# EAGLE design sniff (EAGLE 5.07)
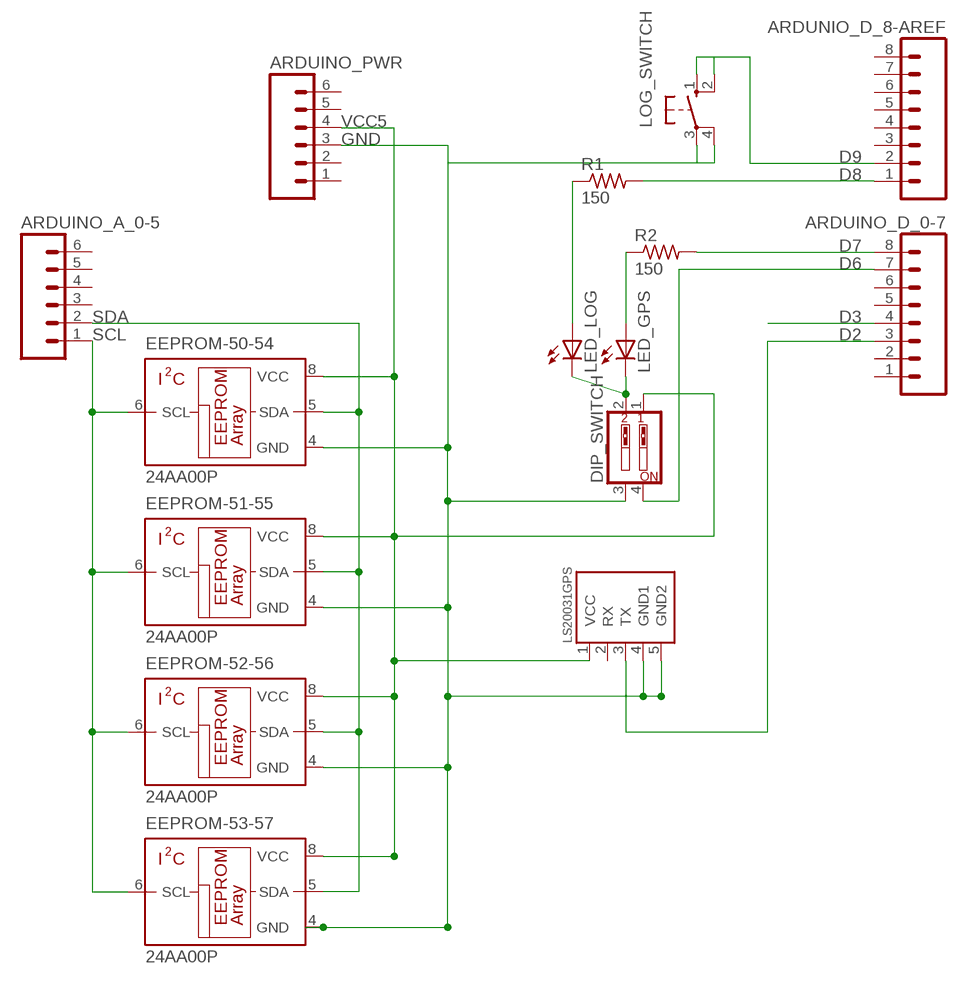
[diagram p0: schematic, sheet 1]

## Parts
ARDUINO_A_0-5  M06SIP  [1X06]
ARDUINO_D_0-7  M08  [1X08]
ARDUINO_PWR  M06SIP  [1X06]
ARDUNIO_D_8-AREF  M08  [1X08]
DIP_SWITCH  SW_DIP-2  [EDG-02]
EEPROM-50-54  24AA00P  [DIL8]
EEPROM-51-55  24AA00P  [DIL8]
EEPROM-52-56  24AA00P  [DIL8]
EEPROM-53-57  24AA00P  [DIL8]
LED_GPS  LED5MM  [LED5MM]
LED_LOG  LED5MM  [LED5MM]
LOG_SWITCH  10-XX  [B3F-10XX]
LS20031GPS  LS20031  [HEADER_1X05]
R1  150  R-US_0207/12  [0207/12]
R2  150  R-US_0207/12  [0207/12]

## Nets
D2: ARDUINO_D_0-7.3 LS20031GPS.3(TX)
D3: ARDUINO_D_0-7.4
D6: ARDUINO_D_0-7.7 DIP_SWITCH.4
D7: ARDUINO_D_0-7.8 R2.2
D8: ARDUNIO_D_8-AREF.1 R1.2
D9: ARDUNIO_D_8-AREF.2 LOG_SWITCH.1(S) LOG_SWITCH.2(S1)
GND: ARDUINO_PWR.3 DIP_SWITCH.3 EEPROM-50-54.4(GND) EEPROM-51-55.4(GND) EEPROM-52-56.4(GND) EEPROM-53-57.4(GND) LOG_SWITCH.3(P) LOG_SWITCH.4(P1) LS20031GPS.4(GND1) LS20031GPS.5(GND2)
N$3: LED_LOG.A R1.1
N$4: DIP_SWITCH.2 LED_GPS.K(C) LED_LOG.K(C)
N$5: LED_GPS.A R2.1
SCL: ARDUINO_A_0-5.1 EEPROM-50-54.6(SCL) EEPROM-51-55.6(SCL) EEPROM-52-56.6(SCL) EEPROM-53-57.6(SCL)
SDA: ARDUINO_A_0-5.2 EEPROM-50-54.5(SDA) EEPROM-51-55.5(SDA) EEPROM-52-56.5(SDA) EEPROM-53-57.5(SDA)
VCC5: ARDUINO_PWR.4 DIP_SWITCH.1 EEPROM-50-54.8(VCC) EEPROM-51-55.8(VCC) EEPROM-52-56.8(VCC) EEPROM-53-57.8(VCC) LS20031GPS.1(VCC)
Unconnected: ARDUINO_A_0-5.3 ARDUINO_A_0-5.4 ARDUINO_A_0-5.5 ARDUINO_A_0-5.6 ARDUINO_D_0-7.1 ARDUINO_D_0-7.2 ARDUINO_D_0-7.5 ARDUINO_D_0-7.6 ARDUINO_PWR.1 ARDUINO_PWR.2 ARDUINO_PWR.5 ARDUINO_PWR.6 ARDUNIO_D_8-AREF.3 ARDUNIO_D_8-AREF.4 ARDUNIO_D_8-AREF.5 ARDUNIO_D_8-AREF.6 ARDUNIO_D_8-AREF.7 ARDUNIO_D_8-AREF.8 LS20031GPS.2(RX)

## Library data of the parts
ARDUINO_A_0-5 ARDUINO_PWR = SparkFun:M06: Header 6 Standard 6-pin 0.1" header. Use with straight break away headers (SKU : PRT-00116), right angle break away headers (PRT-00553), swiss pins (PRT-00743), machine pins (PRT-00117), and female headers (PRT-00115). Molex polarized connector foot print use with SKU : PRT-08094 with associated crimp pins and housings. NOTES ON THE VARIANTS LOCK and LOCK_LONGPADS... This footprint was designed to help hold the alignment of a through-hole component (i.e. 6-pin header) while soldering it into place. You may notice that each hole has been shifted either up or down by 0.005 of an inch from it's more standard position (which is a perfectly straight line). This slight alteration caused the pins (the squares in the middle) to touch the edges of the holes. Because they are alternating, it causes a "brace" to hold the component in place. 0.005 has proven to be the perfect amount of "off-center" position when using our standard breakaway headers. Although looks a little odd when you look at the bare footprint, once you have a header in there, the alteration is very hard to notice. Also, if you push a header all the way into place, it is covered up entirely on the bottom side. This idea of altering the position of holes to aid alignment will be further integrated into the Sparkfun Library for other footprints. It can help hold any component with 3 or more connection pins.
ARDUINO_D_0-7 ARDUNIO_D_8-AREF = SparkFun:M08: Header 8 Standard 8-pin 0.1" header. Use with straight break away headers (SKU : PRT-00116), right angle break away headers (PRT-00553), swiss pins (PRT-00743), machine pins (PRT-00117), and female headers (PRT-00115).
DIP_SWITCH = special:SW_DIP-2: DIP SWITCH
EEPROM-50-54 EEPROM-51-55 EEPROM-52-56 EEPROM-53-57 = microchip:24*00: Serial EEPROM 128 bit, I2C (AA = 1.8 V/LC = 2.5 V/C = 5.0 V)
LED_GPS LED_LOG = led:LED: LED OSRAM: - CHIPLED LG R971, LG N971, LY N971, LG Q971, LY Q971, LO R971, LY R971 LH N974, LH R974 LS Q976, LO Q976, LY Q976 LO Q996 - Hyper CHIPLED LW Q18S LB Q993, LB Q99A, LB R99A - SideLED LS A670, LO A670, LY A670, LG A670, LP A670 LB A673, LV A673, LT A673, LW A673 LH A674 LY A675 LS A676, LA A676, LO A676, LY A676, LW A676 LS A679, LY A679, LG A679 - Hyper Micro SIDELED® LS Y876, LA Y876, LO Y876, LY Y876 LT Y87S - SmartLED LW L88C, LW L88S LB L89C, LB L89S, LG L890 LS L89K, LO L89K, LY L89K LS L896, LA L896, LO L896, LY L896 - TOPLED LS T670, LO T670, LY T670, LG T670, LP T670 LSG T670, LSP T670, LSY T670, LOP T670, LYG T670 LG T671, LOG T671, LSG T671 LB T673, LV T673, LT T673, LW T673 LH T674 LS T676, LA T676, LO T676, LY T676, LB T676, LH T676, LSB T676, LW T676 LB T67C, LV T67C, LT T67C, LS T67K, LO T67K, LY T67K, LW E67C LS E67B, LA E67B, LO E67B, LY E67B, LB E67C, LV E67C, LT E67C LW T67C LS T679, LY T679, LG T679 LS T770, LO T770, LY T770, LG T770, LP T770 LB T773, LV T773, LT T773, LW T773 LH T774 LS E675, LA E675, LY E675, LS T675 LS T776, LA T776, LO T776, LY T776, LB T776 LHGB T686 LT T68C, LB T68C - Hyper Mini TOPLED® LB M676 - Mini TOPLED Santana® LG M470 LS M47K, LO M47K, LY M47K Source: http://www.osram.convergy.de LUXEON: - LUMILED® LXK2-PW12-R00, LXK2-PW12-S00, LXK2-PW14-U00, LXK2-PW14-V00 LXK2-PM12-R00, LXK2-PM12-S00, LXK2-PM14-U00 LXK2-PE12-Q00, LXK2-PE12-R00, LXK2-PE12-S00, LXK2-PE14-T00, LXK2-PE14-U00 LXK2-PB12-K00, LXK2-PB12-L00, LXK2-PB12-M00, LXK2-PB14-N00, LXK2-PB14-P00, LXK2-PB14-Q00 LXK2-PR12-L00, LXK2-PR12-M00, LXK2-PR14-Q00, LXK2-PR14-R00 LXK2-PD12-Q00, LXK2-PD12-R00, LXK2-PD12-S00 LXK2-PH12-R00, LXK2-PH12-S00 LXK2-PL12-P00, LXK2-PL12-Q00, LXK2-PL12-R00 Source: www.luxeon.com KINGBRIGHT: KA-3528ASYC Source: www.kingbright.com
LOG_SWITCH = switch-omron:10-XX: OMRON SWITCH
LS20031GPS = microbuilder:LS20031: GPS Devices LS20031 - LS20031 10Hz UART GPS [Prod. ID] (Footprint for 0.1" header pins)
R1 R2 = rcl:R-US_: RESISTOR, American symbol

## Board
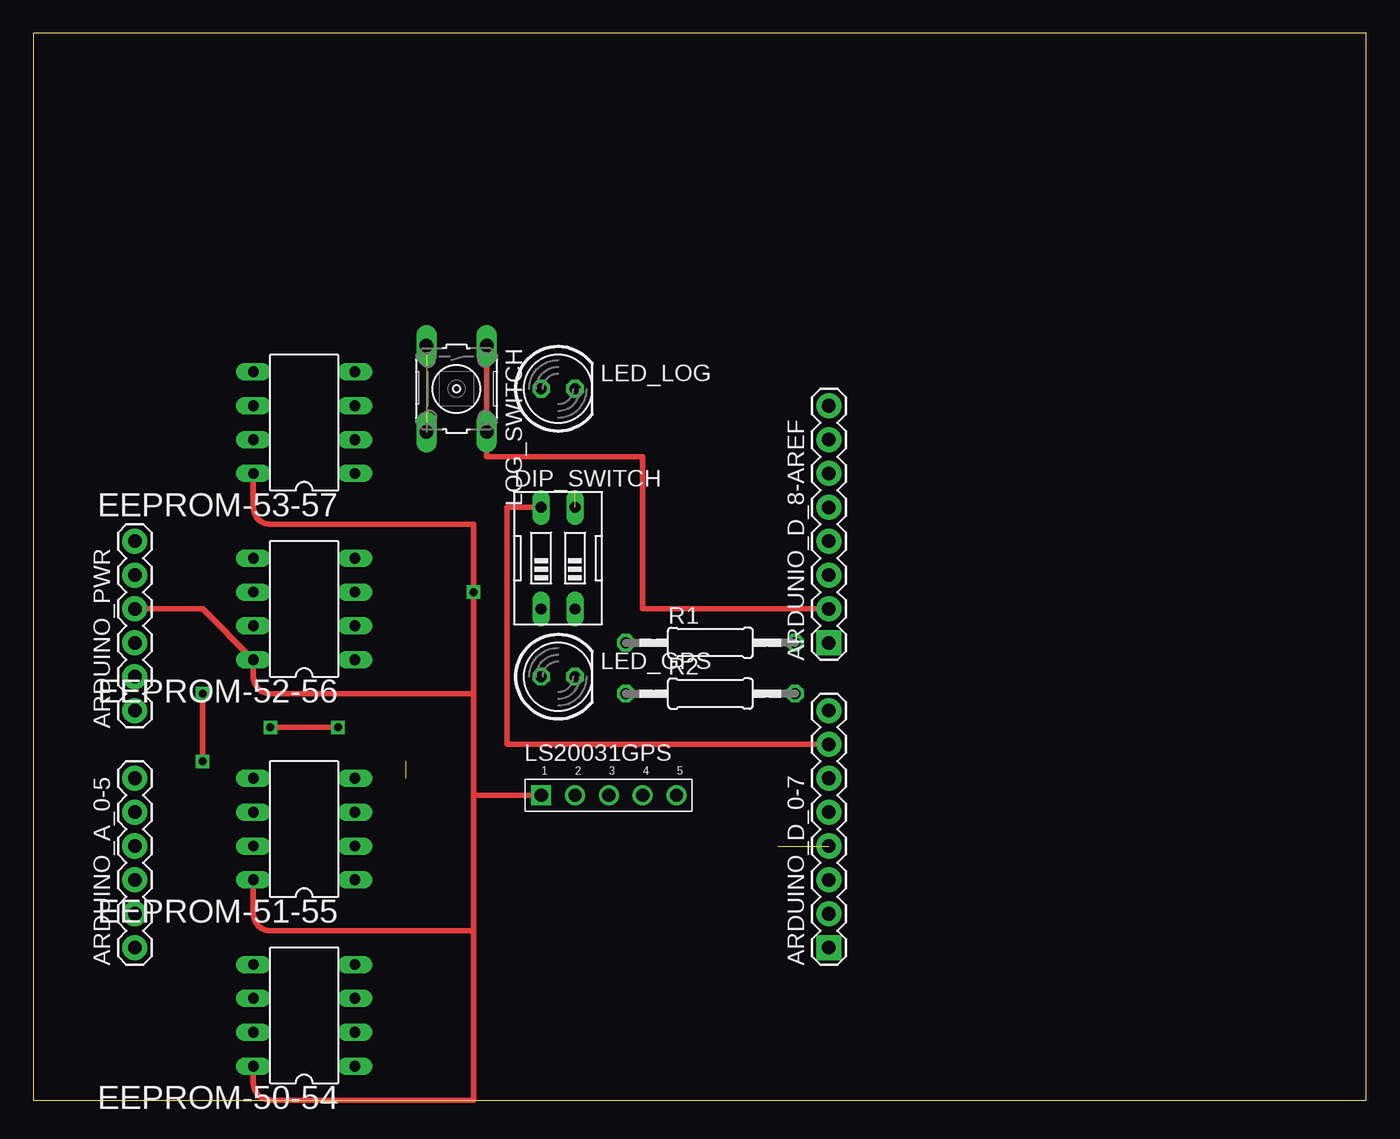
[diagram p1: board, top side]
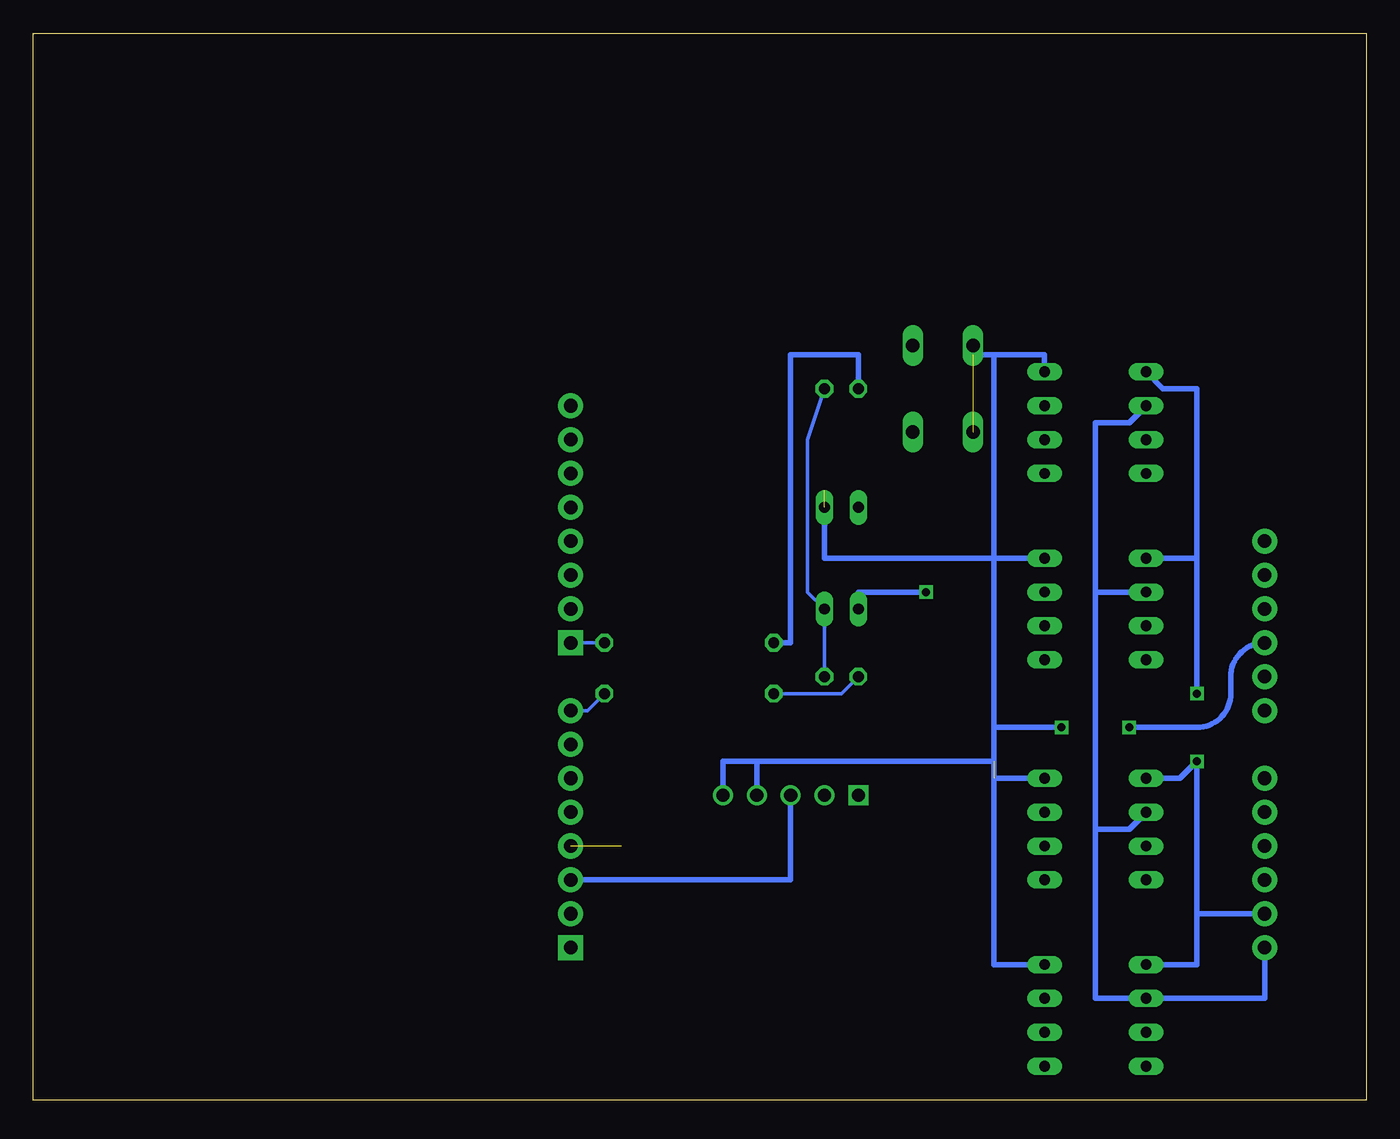
[diagram p2: board, bottom side, seen from below]

Size 100 x 80 mm. Coordinates in mm from the lower left corner, seen from the top.
Outline: 0,0 100,0 100,80 0,80 0,0
Copper layers (1*16): Top 0.035mm / dielectric 1.5mm / Bottom 0.035mm
Design rules "default": minimum track width 10mil, minimum drill 24mil, track to track 8mil, track to pad 8mil, pad to pad 8mil, via to via 8mil, smd to smd 8mil, copper to edge 40mil, drill to drill 8mil, minimum pad ring 10mil, minimum via ring 8mil, stop-mask expansion 4mil, vias tented up to drill 0mil, thermal gap 10mil

### Footprints (pad centres in the part's own frame; a part is rotated, then mirrored left to right if it is on the bottom)
1X06 = drill 1.016 pad 1.88 round: 1 0,0; 2 2.54,0; 3 5.08,0; 4 7.62,0; 5 10.16,0; 6 12.7,0
1X08 = drill 1.016 pad 1.88 square: 1 0,0 | drill 1.016 pad 1.88 round: 2 2.54,0; 3 5.08,0; 4 7.62,0; 5 10.16,0; 6 12.7,0; 7 15.24,0; 8 17.78,0
EDG-02 = drill 0.813 long: 1 -1.27,-3.81; 2 1.27,-3.81; 3 1.27,3.81; 4 -1.27,3.81
DIL8 = drill 0.813 long: 1 -3.81,-3.81; 2 -1.27,-3.81; 3 1.27,-3.81; 4 3.81,-3.81; 5 3.81,3.81; 6 1.27,3.81; 7 -1.27,3.81; 8 -3.81,3.81
LED5MM = drill 0.813 octagon: A -1.27,0; K 1.27,0
B3F-10XX = drill 1.016 long: 1 -3.251,2.261; 2 3.251,2.261; 3 -3.251,-2.261; 4 3.251,-2.261
HEADER_1X05 = drill 1 square: 1 0,0 | drill 1 round: 2 2.54,0; 3 5.08,0; 4 7.62,0; 5 10.16,0
0207/12 = drill 0.813 octagon: 1 -6.35,0; 2 6.35,0

### Placement (x,y rotation side)
ARDUINO_A_0-5  7.62,11.43 90 top
ARDUINO_D_0-7  59.69,11.43 90 top
ARDUINO_PWR  7.62,29.21 90 top
ARDUNIO_D_8-AREF  59.69,34.29 90 top
DIP_SWITCH  39.37,40.64 0 top
EEPROM-50-54  20.32,6.35 90 top
EEPROM-51-55  20.32,20.32 90 top
EEPROM-52-56  20.32,36.83 90 top
EEPROM-53-57  20.32,50.8 90 top
LED_GPS  39.37,31.75 0 top
LED_LOG  39.37,53.34 0 top
LOG_SWITCH  31.75,53.34 270 top
LS20031GPS  38.1,22.86 0 top
R1  50.8,34.29 0 top
R2  50.8,30.48 0 top

### Tracks (layer width: path | path; a pad name or v marks a point on that pad's centre or on a via)
D2
  Bottom 0.406: ARDUINO_D_0-7.3 43.18,16.51 LS20031GPS.3
D3  (1 unrouted)
D6
  Top 0.406: ARDUINO_D_0-7.7 35.56,26.67 35.56,44.45 DIP_SWITCH.4
D7
  Bottom 0.254: R2.2 58.42,29.21 ARDUINO_D_0-7.8
D8
  Bottom 0.254: R1.2 ARDUNIO_D_8-AREF.1
D9
  Top 0.406: LOG_SWITCH.1 LOG_SWITCH.2 34.01,48.26 45.72,48.26 45.72,36.83 ARDUNIO_D_8-AREF.2
GND  (via drill 0.6)  (3 unrouted)
  Top 0.406: v22.86,27.94 v17.78,27.94
  Bottom 0.406: LS20031GPS.5 48.26,25.4 45.72,25.4 | 27.94,25.4 45.72,25.4 | 45.72,25.4 LS20031GPS.4 | 27.94,24.13 27.94,27.94 | 27.94,27.94 27.94,40.64 | 27.94,55.88 29.49,55.88 LOG_SWITCH.3 | 27.94,55.88 24.13,55.88 EEPROM-53-57.4 | 27.94,40.64 27.94,55.88 | 27.94,40.64 EEPROM-52-56.4 | 27.94,24.13 EEPROM-51-55.4 | 27.94,24.13 27.94,10.16 EEPROM-50-54.4 | 27.94,27.94 v22.86,27.94 | v17.78,27.94 12.7,27.94 arc-90 10.16,30.48 10.16,31.75 arc90 ARDUINO_PWR.3 | DIP_SWITCH.3 40.64,40.64 27.94,40.64
N$3
  Bottom 0.406: R1.1 43.18,34.29 43.18,55.88 38.1,55.88 LED_LOG.A
N$4
  Bottom 0.254: LED_GPS.K DIP_SWITCH.2 41.91,38.1 41.91,49.53 LED_LOG.K
N$5
  Bottom 0.254: LED_GPS.A 39.37,30.48 R2.1
SCL
  Bottom 0.406: ARDUINO_A_0-5.1 7.62,7.62 EEPROM-50-54.6 20.32,7.62 20.32,20.32 | EEPROM-51-55.6 17.78,20.32 20.32,20.32 | 20.32,20.32 20.32,38.1 | 20.32,38.1 EEPROM-52-56.6 | EEPROM-53-57.6 17.78,50.8 20.32,50.8 20.32,38.1
SDA  (via drill 0.6)
  Top 0.406: v12.7,25.4 v12.7,30.48
  Bottom 0.406: ARDUINO_A_0-5.2 12.7,13.97 | EEPROM-53-57.5 15.24,53.34 12.7,53.34 12.7,40.64 | 12.7,40.64 EEPROM-52-56.5 | v12.7,30.48 12.7,40.64 | 12.7,13.97 v12.7,25.4 13.97,24.13 EEPROM-51-55.5 | 12.7,13.97 12.7,10.16 EEPROM-50-54.5
VCC5  (via drill 0.6)
  Top 0.406: 33.02,22.86 LS20031GPS.1 | 33.02,22.86 33.02,30.48 | 33.02,30.48 17.78,30.48 arc-90 16.51,31.75 EEPROM-52-56.8 12.7,36.83 ARDUINO_PWR.4 | EEPROM-51-55.8 16.51,13.97 arc90 17.78,12.7 33.02,12.7 | 33.02,12.7 33.02,22.86 | EEPROM-53-57.8 16.51,44.45 arc90 17.78,43.18 33.02,43.18 v33.02,38.1 33.02,30.48 | EEPROM-50-54.8 16.51,1.27 arc90 17.78,0 33.02,0 33.02,12.7
  Bottom 0.406: DIP_SWITCH.1 38.1,38.1 v33.02,38.1